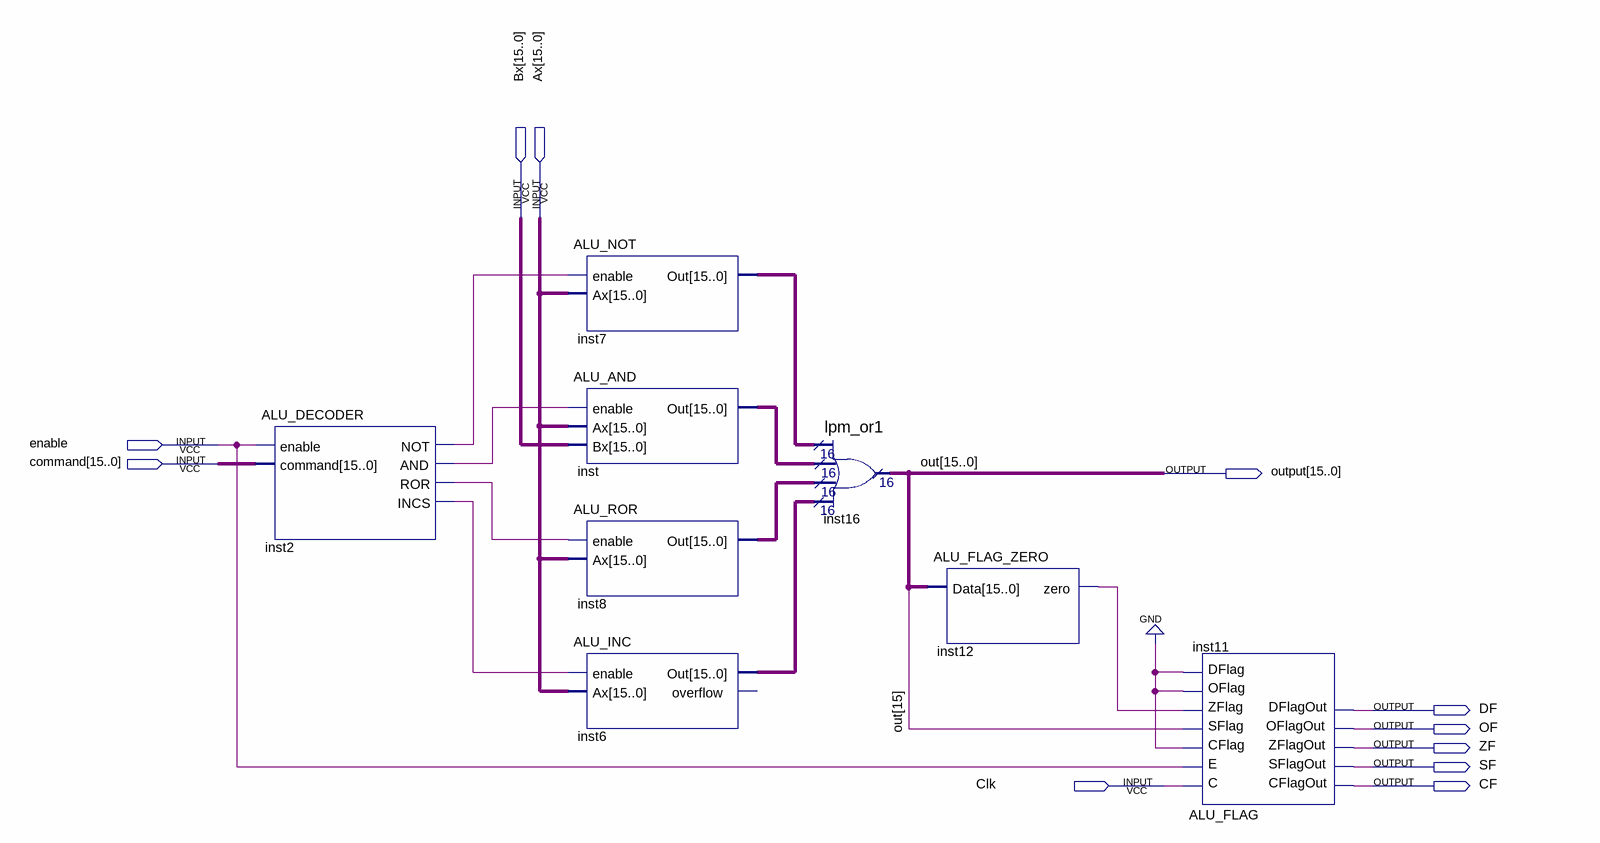
[diagram p0: schematic sheet]
// Quartus schematic ALU_MAIN.bdf as structural Verilog: 8 symbols, 11 pins
module ALU_MAIN (
  input  [15:0] Bx,
  input  [15:0] Ax,
  input  enable,
  input  [15:0] command,
  input  Clk,
  output [15:0] \output ,
  output DF,
  output OF,
  output ZF,
  output SF,
  output CF
);

  wire inst2_and, inst2_incs, inst2_not, inst2_ror, inst12_zero;
  wire [15:0] inst6_out, inst7_out, inst8_out, inst_out;

  ALU_DECODER inst2 (
    .enable(enable), .command(command), .NOT(inst2_not), .AND(inst2_and), .ROR(inst2_ror), .INCS(inst2_incs));
  ALU_NOT inst7 (.enable(inst2_not), .Ax(Ax), .Out(inst7_out));
  ALU_AND inst (.enable(inst2_and), .Ax(Ax), .Bx(Bx), .Out(inst_out));
  ALU_ROR inst8 (.enable(inst2_ror), .Ax(Ax), .Out(inst8_out));
  ALU_INC inst6 (.enable(inst2_incs), .Ax(Ax), .Out(inst6_out));  // open: overflow
  lpm_or1 inst16 (.data0x(inst7_out), .data1x(inst_out), .data2x(inst8_out), .data3x(inst6_out), .result(\output ));
  ALU_FLAG_ZERO inst12 (.Data(\output ), .zero(inst12_zero));
  ALU_FLAG inst11 (
    .C(Clk), .E(enable), .CFlag(1'b0), .SFlag(\output [15]), .ZFlag(inst12_zero), .OFlag(1'b0), .DFlag(1'b0),
    .CFlagOut(CF), .SFlagOut(SF), .ZFlagOut(ZF), .OFlagOut(OF), .DFlagOut(DF));

  // Other names for the same wires on the sheet: out[15:0] = \output 
endmodule
